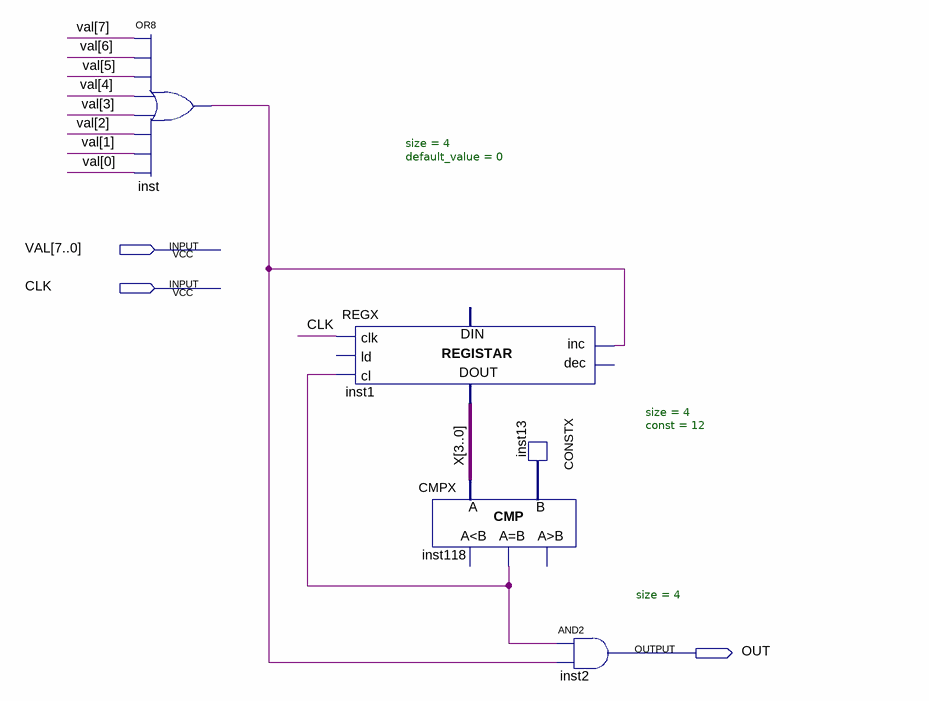
[diagram p0: schematic sheet]
// Quartus schematic Booster.bdf as structural Verilog: 5 symbols, 3 pins
module Booster (
  input  [7:0] VAL,
  input  CLK,
  output OUT
);

  wire inst118_eq, inst_out;
  wire [3:0] inst13_data, X;

  or inst (inst_out, VAL[7], VAL[6], VAL[5], VAL[4], VAL[3], VAL[2], VAL[1], VAL[0]);
  REGX #(.size(4), .default_value(0)) inst1 (
    .clk(CLK), .cl(inst118_eq), .inc(inst_out), .data_out(X));  // open: ld, dec, data_in
  CMPX #(.size(4)) inst118 (.A(X), .B(inst13_data), .eq(inst118_eq));  // open: ls, gr
  CONSTX #(.size(4), .\const (12)) inst13 (.data(inst13_data));
  and inst2 (OUT, inst118_eq, inst_out);
endmodule
